# Altium schematic sheet DHT11_Driver_Schematic.SchDoc
size A; SheetNumber: 1; SheetTotal: 1
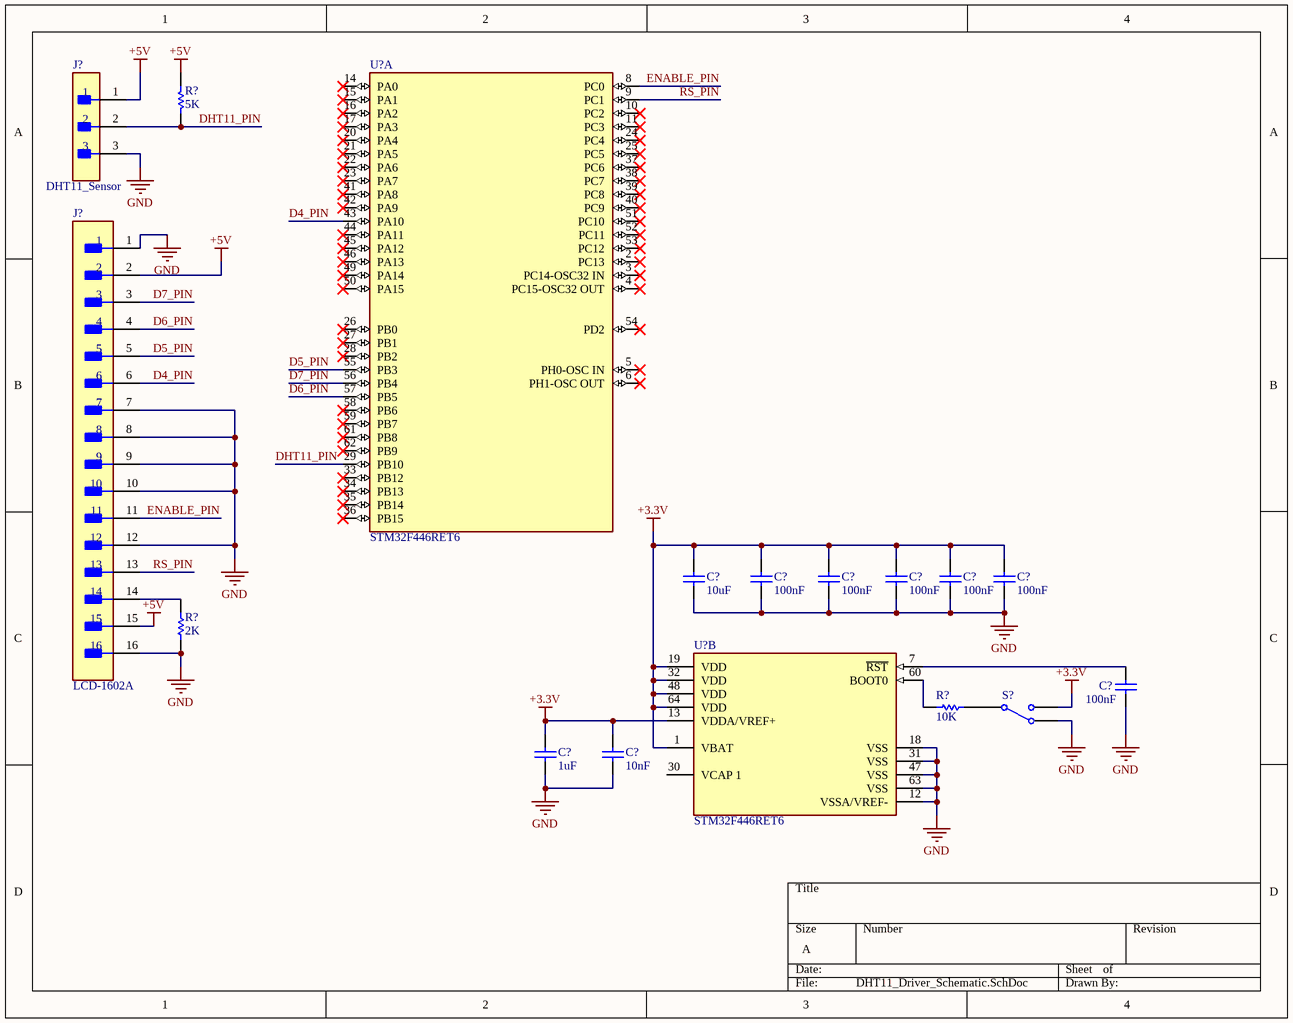
[diagram p0: DHT11_Driver_Schematic.SchDoc]

## Parts
(Parts that share a designator on the sheet are numbered #1, #2 ... from top to bottom, then left to right.)
C?#1  value 10uF  (hidden comment: Capacitor)
C?#2  value 100nF  (hidden comment: Capacitor)
C?#3  value 100nF  (hidden comment: Capacitor)
C?#4  value 100nF  (hidden comment: Capacitor)
C?#5  value 100nF  (hidden comment: Capacitor)
C?#6  value 100nF  (hidden comment: Capacitor)
C?#7  value 100nF  (hidden comment: Capacitor)
C?#8  value 1uF  (hidden comment: Capacitor)
C?#9  value 10nF  (hidden comment: Capacitor)
J?#1  DHT11_Sensor  [FP-22-28-4035-MFG]
J?#2  LCD-1602A  [FP-PEC16SABN-MFG]
R?#1  value 5K  (hidden comment: Resistor)
R?#2  value 2K  (hidden comment: Resistor)
R?#3  value 10K  (hidden comment: Resistor)
S?  Single-Pole, Double-Throw Switch  (value not drawn)
U?#1  STM32F446RET6  [FP-LQFP64-5W-MFG]  (part A of 2)
U?#2  STM32F446RET6  [FP-LQFP64-5W-MFG]  (part B of 2)

## Nets
+3.3V: C?#1.2 C?#2.2 C?#3.2 C?#4.2 C?#5.2 C?#6.2 C?#8.2 C?#9.2 S?.2 U?#2.1(VBAT) U?#2.13(VDDA/VREF+) U?#2.19(VDD) U?#2.32(VDD) U?#2.48(VDD) U?#2.64(VDD)
+5V: J?#1.1 J?#2.2 J?#2.15 R?#1.1
GND: C?#1.1 C?#2.1 C?#3.1 C?#4.1 C?#5.1 C?#6.1 C?#7.1 C?#8.1 C?#9.1 J?#1.3 J?#2.1 J?#2.7 J?#2.8 J?#2.9 J?#2.10 J?#2.12 J?#2.16 R?#2.1 S?.3 U?#2.12(VSSA/VREF-) U?#2.18(VSS) U?#2.31(VSS) U?#2.47(VSS) U?#2.63(VSS)
D4_PIN: J?#2.6 U?#1.43(PA10)
D5_PIN: J?#2.5 U?#1.55(PB3)
D6_PIN: J?#2.4 U?#1.57(PB5)
D7_PIN: J?#2.3 U?#1.56(PB4)
DHT11_PIN: J?#1.2 R?#1.2 U?#1.29(PB10)
ENABLE_PIN: J?#2.11 U?#1.8(PC0)
RS_PIN: J?#2.13 U?#1.9(PC1)
NetC?#7_2: C?#7.2 U?#2.7(~{RST})
NetJ?#2_14: J?#2.14 R?#2.2
NetR?#3_1: R?#3.1 U?#2.60(BOOT0)
NetR?#3_2: R?#3.2 S?.1

Not connected (* = marked no-connect by the designer): U?#1 2(PC13)* 3(PC14-OSC32_IN)* 4(PC15-OSC32_OUT)* 5(PH0-OSC_IN)* 6(PH1-OSC_OUT)* 10(PC2)* 11(PC3)* 14(PA0)* 15(PA1)* 16(PA2)* 17(PA3)* 20(PA4)* 21(PA5)* 22(PA6)* 23(PA7)* 24(PC4)* 25(PC5)* 26(PB0)* 27(PB1)* 28(PB2)* 33(PB12)* 34(PB13)* 35(PB14)* 36(PB15)* 37(PC6)* 38(PC7)* 39(PC8)* 40(PC9)* 41(PA8)* 42(PA9)* 44(PA11)* 45(PA12)* 46(PA13)* 49(PA14)* 50(PA15)* 51(PC10)* 52(PC11)* 53(PC12)* 54(PD2)* 58(PB6)* 59(PB7)* 61(PB8)* 62(PB9)*; U?#2 30(VCAP_1)

## Library data of the parts
C?#1-C?#9 = Capacitor: SimulationGenericComponent: True
J?#1 = CMP-00257-00247547-1: 22-28-4035 BOARD-BOARD Connector HEADER, 3WAY, 1ROW; Series: KK; Pitch Spacing: 2.54mm; No. of Rows: 1;; Manufacturer Lifecycle Status: ACTIVE; NexarPartId: 247547; Plating: Tin; Max Voltage Rating (DC): 250.25kV; Voltage Rating: 250V; Current Rating: 4A; Gender: Male; Glow Wire Compliant: Non-compliant; Number of Positions: 3; Connector Type: Male Pin; Contact Resistance: 20mΩ; Color: Black; Contact Plating: Gold; Contact Material: Brass; Lead Free: Lead Free; Number of Rows: 1; Housing Material: Thermoplastic; Min Operating Temperature: 0°C; Country of Origin: US; REACH SVHC: Unknown; Lifecycle Status: Production; Mount: Through Hole; Schedule B: 8536694040; RoHS: Compliant; Termination: Through Hole; Max Operating Temperature: 75°C; Pitch: 2.54mm; Packaging: Bulk; Number of Circuits: 3; Contact Mating Length: 7.493mm; Orientation: Vertical; Housing Color: Black; Number of Contacts: 3
J?#2 = CMP-25680-000075-1: CONN HEADER VERT 16POS 2.54MM; Gender: Male; Number of Contacts: 16; Connector Type: Male Pin; Pitch: 0.1inch; Contact Type: Male Pin; Mount: Through Hole; Lead Free: Lead Free; Height: 2.54mm; Packaging: Bulk; Package Quantity: 1; Termination: Solder; Contact Plating: Tin; Color: Black; RoHS Compliant: Yes; Housing Material: Plastic; Contact Mating Length: 0.23inch; Number of Positions: 16; Width: 2.54mm; Contact Material: Bronze; Length: 40.6mm; Housing Color: Black; Number of Rows: 1
R?#1-R?#3 = Resistor: TC1: 0; SimulationGenericComponent: True; TC2: 0
S? = SPDT SW: nodeUP_closed: 1; Rclosed: 1m; Ropen: 1Meg; SimulationGenericComponent: True
U?#1 U?#2 = CMP-12105-000007-1: IC MCU 32BIT 512KB FLASH 64LQFP; Manufacturer: ST; Number Of Spi Channels: 4; Ram Size: 128KBytes; Standoff Height: 0.05mm; Number Of Uart Channels: 6; Number Of Pwm Channels: 32; Max Junction Temp: +105°C; Number Of I/Os: 50; Number Of Usb Channels: 2; Frequency: 180MHz; Number Of A/D Converters: 3; Max Supply Voltage: 3.6V; Number Of Adc Channels: 16; Interface: I2C,SPI,UART,USART,CAN,USB,LIN,IrDA,I2S,Other; Memory Size: 512KBytes; Number Of Timers/Counters: 14; Min Supply Voltage: 1.7V; Core Architecture: ARM Cortex-M4; Data Bus Width: 32bits; Number Of Cores: 1; Ambient Temperature Range Low: -40°C; ComponentLink2URL: https://www.st.com/en/microcontrollers-microprocessors/stm32f446re.html; Category: IC; Height: 1.6mm; Ipc Land Pattern Name: QFP50P1200X1200X160-64; Manufacturer Part Number: STM32F446RET6; Octopart: https://octopart.com/stm32f446ret6-stmicroelectronics-52642920; Temperature Range High: +105°C; Lead Free: Yes; Mouser Description: ARM Microcontrollers - MCU High-performance and DSP with FP, ARM Cortex-M4 MCU with 512 Kbytes Flash, 180 MHz CPU, Art Accelerator, SDRAM; Digikey Description: IC MCU 32BIT 512KB FLASH 64LQFP; Ambient Temperature Range High: +85°C; Number Of I2C Channels: 4; Memory Type: FLASH; RoHS: TRUE; Automotive: No; Device Class L1: Integrated Circuits (ICs); Temperature: -40°C to +105°C; Device Class L2: Embedded Processors and Controllers; Device Class L3: Microcontrollers; Temperature Range Low: -40°C; Package: LQFP64-5W; ComponentLink2Description: Datasheet